# EasyEDA Pro project ProPrj_ExtModule-002_2025-02-19.epro

# Schematic ExtModule-002
Board Name: ExtModule-002; Create Date: 2025-01-21; Page Name: Core; Project Name: ExtModule-002; Schematic Name: Schematic-ExtModule-002; Update Date: 2025-01-21; Company: 嘉立创EDA; Page Size: A4; Version: V1.0
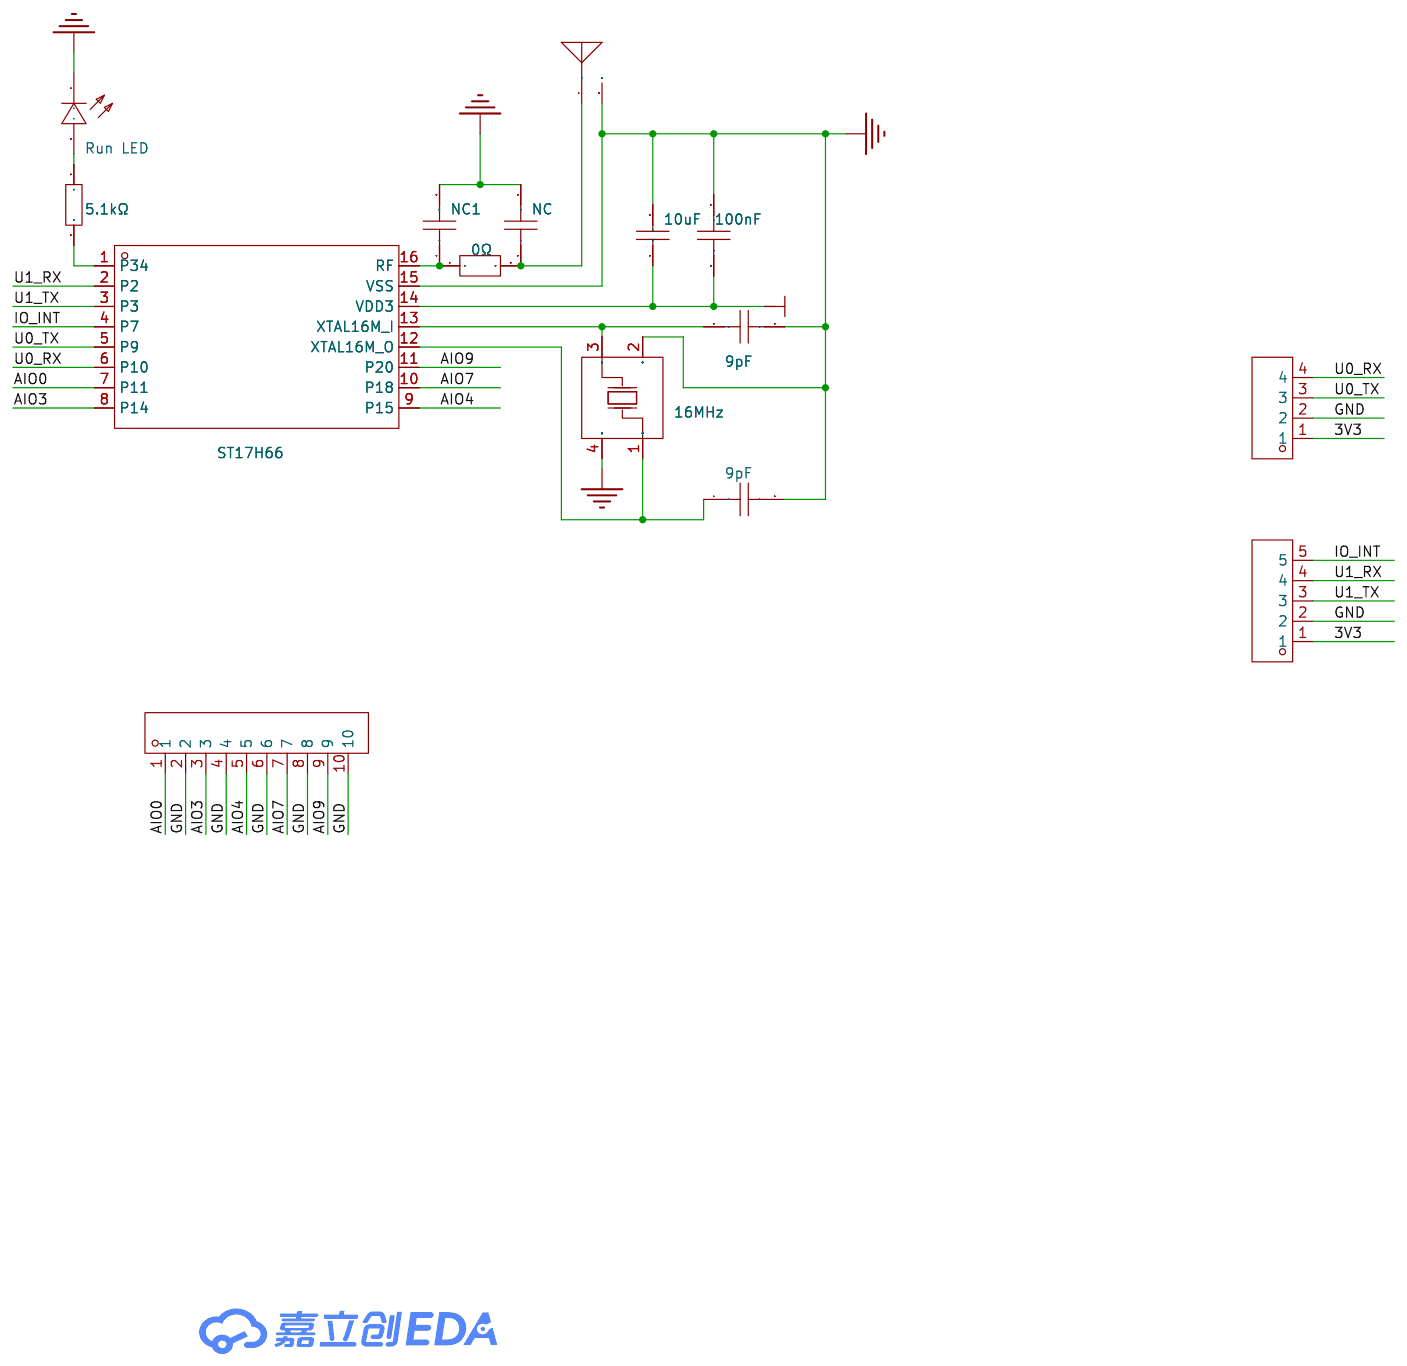
[diagram p0: schematic sheet]

## Parts
C3  100nF  [C0402]
C4  10uF  [C0402]
C5  9pF  [C0402]
C6  9pF  [C0402]
H1  PZ254V-11-04P  [HDR-TH_4P-P2.54-V-M]  (no BOM)
H2  PZ254V-11-05P  [HDR-TH_5P-P2.54-V-M]  (no BOM)
H3  PZ254V-11-10P  [HDR-TH_10P-P2.54-V-M]  (no BOM)
L1  KH-3216-A27  [ANT-SMD_L3.2-W1.6]
LED2  Run LED  [LED0603-RD_RED]
NC  9pF  [C0402]  (no BOM)
NC1  9pF  [C0402]  (no BOM)
R1  0Ω  [R0402]
R18  5.1kΩ  [R0402]
U1  ST17H66  [TSSOP-16_L5.0-W4.4-P0.65-LS6.4-BL]
X1  16MHz  [OSC-SMD_4P-L3.2-W2.5-BL]

## Library data of the parts
C3 = CC0402KRX7R7BB104: 容值:100nF;精度:±10%;额定电压:16V;材质(温度系数):X7R;; LCSC Part Name: 100nF ±10% 16V; Supplier Part: C60474; Manufacturer: YAGEO(国巨); Supplier Footprint: 0402; JLCPCB Part Class: Extended Part; Datasheet: https://atta.szlcsc.com/upload/public/pdf/source/20211223/9278FD768280B81DDBEF48FA36411A03.pdf; Supplier: LCSC; Tolerance: ±10%; Voltage Rated: 16V; Temperature Coefficient: X7R
C4 = CL05A106MQ5NUNC: 容值:10uF;精度:±20%;额定电压:6.3V;材质(温度系数):X5R;; LCSC Part Name: 10uF ±20% 6.3V; Supplier Part: C15525; Manufacturer: SAMSUNG(三星); Supplier Footprint: 0402; JLCPCB Part Class: 基础库; Datasheet: https://atta.szlcsc.com/upload/public/pdf/source/20220823/2B02EE04F8F211D38A52DCB16EB6BEBA.pdf; Supplier: LCSC; Tolerance: ±20%; Voltage Rated: 6.3V; Temperature Coefficient: X5R
C5 C6 = GJM1555C1H9R0CB01D: 容值:9pF;额定电压:50V;材质(温度系数):C0G;; LCSC Part Name: 9pF 50V ±0.25pF; Supplier Part: C85884; Manufacturer: muRata(村田); Supplier Footprint: 0402; JLCPCB Part Class: 扩展库; Datasheet: https://atta.szlcsc.com/upload/public/pdf/source/20200305/C490387_23319AE8C154DEB24C505E6C82A8106A.pdf; Supplier: LCSC; Voltage Rated: 50V; Temperature Coefficient: C0G
H1 = PZ254V-11-04P: 插针结构:1x4P;间距:2.54mm;行距:-;圆针/方针:方针;安装类型:直插;排数:单排;总PIN位数:4P;额定电流:3A;额定电压:250V;配合针长度:6mm;塑高:2.5mm;端接针长度:3mm;触头材质:-;工作温度范围:-40℃~+105℃;颜色:黑色;; LCSC Part Name: 间距:2.54mm 1x4P 直插 方针; Supplier Part: C2691448; Manufacturer: XFCN(兴飞); Supplier Footprint: 插件,P=2.54mm; JLCPCB Part Class: 扩展库; Datasheet: https://atta.szlcsc.com/upload/public/pdf/source/20200309/C492403_F9F19131791D08044AD4F84F8E751A34.pdf; Supplier: LCSC; Pin Structure: 1x4P; Pitch: 2.54mm; Circluar Pins/Square Pins: 方针; Mounting Type: 直插; Number of Rows: 单排; Number of Pins: 4P; Current Rating (Max): 3A; Voltage Rating (Max): 250V; Length of Mating Pin: 6mm; Insulation Height: 2.5mm; Length of End Connection Pin: 3mm; Operating Temperature Range: -40℃~+105℃; Color: 黑色
H2 = PZ254V-11-05P: 插针结构:1x5P;间距:2.54mm;行距:-;圆针/方针:方针;安装类型:直插;排数:单排;总PIN位数:5P;额定电流:-;额定电压:-;配合针长度:6mm;塑高:2.5mm;端接针长度:3mm;触头材质:黄铜;触头镀层:-;工作温度范围:-40℃~+105℃;颜色:黑色;; LCSC Part Name: 间距:2.54mm 1x5P 直插 方针; Supplier Part: C492404; Manufacturer: XFCN(兴飞); Supplier Footprint: 插件,P=2.54mm; JLCPCB Part Class: 扩展库; Datasheet: https://atta.szlcsc.com/upload/public/pdf/source/20200309/C492404_E51533260F8710EFF5D4617281164C1D.pdf; Supplier: LCSC; Pin Structure: 1x5P; Pitch: 2.54mm; Circluar Pins/Square Pins: 方针; Mounting Type: 直插; Number of Rows: 单排; Number of Pins: 5P; Length of Mating Pin: 6mm; Insulation Height: 2.5mm; Length of End Connection Pin: 3mm; Contact Material: 黄铜; Operating Temperature Range: -40℃~+105℃; Color: 黑色
H3 = PZ254V-11-10P: 插针结构:1x10P;间距:2.54mm;行距:-;圆针/方针:方针;安装类型:直插;排数:单排;总PIN位数:10P;额定电流:-;额定电压:-;配合针长度:6mm;塑高:2.5mm;端接针长度:3mm;触头材质:黄铜;触头镀层:-;工作温度范围:-40℃~+105℃;颜色:黑色;; LCSC Part Name: 间距:2.54mm 1x10P 直插 方针; Supplier Part: C492409; Manufacturer: XFCN(兴飞); Supplier Footprint: 插件,P=2.54mm; JLCPCB Part Class: 扩展库; Datasheet: https://atta.szlcsc.com/upload/public/pdf/source/20200309/C492409_129C9431BDD62EBBBD0A643B6AAB9FBD.pdf; Supplier: LCSC; Pin Structure: 1x10P; Pitch: 2.54mm; Circluar Pins/Square Pins: 方针; Mounting Type: 直插; Number of Rows: 单排; Number of Pins: 10P; Length of Mating Pin: 6mm; Insulation Height: 2.5mm; Length of End Connection Pin: 3mm; Contact Material: 黄铜; Operating Temperature Range: -40℃~+105℃; Color: 黑色
L1 = KH-3216-A27: LCSC Part Name: Chip蓝牙贴片3.2x1.6; Supplier Part: C504001; Manufacturer: kinghelm(金航标); Supplier Footprint: 1206; JLCPCB Part Class: 扩展库; Datasheet: https://atta.szlcsc.com/upload/public/pdf/source/20200330/C504001_1885788A99ECD25C59FD63C2239A9775.pdf; Supplier: LCSC
LED2 = NCD0603R1_C84263: 灯头类型:-;发光颜色:红色;正向电压(VF):1.6V~2.6V;功率:65mW;正向电流:20mA;主波长:615nm~630nm;二极管配置:独立二极管;透镜颜色:无色透明透镜;色温:-;发光强度:80mcd~220mcd;发光角度:130°;载带方式:-;工作温度:-30℃~+85℃;; LCSC Part Name: NCD0603R1; Supplier Part: C84263; Manufacturer: 国星光电; Manufacturer Part: NCD0603R1; Supplier Footprint: 0603; JLCPCB Part Class: 扩展库; Datasheet: https://atta.szlcsc.com/upload/public/pdf/source/20200820/C84263_DABC6A75E58F576973B407FDBA283D60.pdf; Supplier: LCSC; Emitted Color: 红色; Forward Voltage (VF): 1.6V~2.6V; Power Dissipation: 65mW; Forward Current: 20mA; Dominant Wavelength: 615nm~630nm; Diode Configuration: 独立二极管; Lens Color: 无色透明透镜; Luminous Intensity: 80mcd~220mcd; Viewing Angle: 130°; Operating Temperature: -30℃~+85℃
NC NC1 = CC0402CRNPO9BN9R0: 容值:9pF;额定电压:50V;材质(温度系数):NP0;; LCSC Part Name: 9pF 50V; Supplier Part: C282242; Manufacturer: YAGEO(国巨); Supplier Footprint: 0402; JLCPCB Part Class: 扩展库; Datasheet: https://atta.szlcsc.com/upload/public/pdf/source/20181008/C309499_21CC21451B82C39E3D92150FD6B30293.pdf; Supplier: LCSC; Voltage Rated: 50V; Temperature Coefficient: NP0
R1 = FRC0402P000 TS: 电阻类型:厚膜电阻;阻值:0Ω;精度:±5%;功率:62.5mW;最大工作电压:50V;; LCSC Part Name: 0Ω ±5% 62.5mW 厚膜电阻; Supplier Part: C2906877; Manufacturer: FOJAN(富捷); Supplier Footprint: 0402; JLCPCB Part Class: 扩展库; Datasheet: https://atta.szlcsc.com/upload/public/pdf/source/20211221/925EC7D7225764EE0046F22065062C87.pdf; Supplier: LCSC; Type: 厚膜电阻; Tolerance: ±5%; Power(Watts): 62.5mW; Overload Voltage (Max): 50V; Operating Temperature Range: -55℃~+155℃
R18 = 0402WGF5101TCE: 阻值:5.1kΩ;精度:±1%;功率:62.5mW;温度系数:±100ppm/℃;电阻类型:厚膜电阻;; LCSC Part Name: 5.1kΩ ±1% 62.5mW 厚膜电阻; Supplier Part: C25905; Manufacturer: UNI-ROYAL(厚声); Supplier Footprint: 0402; JLCPCB Part Class: Basic Part; Datasheet: https://atta.szlcsc.com/upload/public/pdf/source/20200306/C422600_1E6D84923E4A46A82E41ADD87F860B5C.pdf; Supplier: LCSC; Tolerance: ±1%; Power(Watts): 62.5mW; Overload Voltage (Max): 50V; Temperature Coefficient: ±100ppm/℃; Type: 厚膜电阻; Operating Temperature Range: -55℃~+155℃
U1 = ST17H66_C9900054761: Supplier Part: C9900054761; Supplier Footprint: TSSOP16; Supplier: LCSC
X1 = X322516MLB4SI: 晶振类型:贴片晶振;频率:16MHz;常温频差:±10ppm;外接负载电容:9pF;频率稳定度(全温):±20ppm;; LCSC Part Name: 16MHz ±10ppm 9pF; Supplier Part: C13738; Manufacturer: YXC(扬兴晶振); Supplier Footprint: SMD3225-4P; JLCPCB Part Class: 基础库; Datasheet: https://atta.szlcsc.com/upload/public/pdf/source/20240329/19D5F850207469550BEB00D7DFEDBC7A.pdf; Supplier: LCSC; Crystal Type: 贴片晶振; Normal temperature Frequency Tolerance: ±10ppm; External load capacitor: 9pF; Frequency Stability(Full temperature range): ±20ppm; Operating Temperature: -40℃~+85℃

## Nets
3V3: C3.2 C4.2 H1.1 H2.1 U1.14(VDD3)
GND: C3.1 C4.1 C5.2 C6.2 H1.2 H2.2 H3.2 H3.4 H3.6 H3.8 H3.10 L1.2 LED2.1(K) NC.2 NC1.2 U1.15(VSS) X1.2(GND) X1.4(GND)
AIO0: H3.1 U1.7(P11)
AIO3: H3.3 U1.8(P14)
AIO4: H3.5 U1.9(P15)
AIO7: H3.7 U1.10(P18)
AIO9: H3.9 U1.11(P20)
IO_INT: H2.5 U1.4(P7)
U0_RX: H1.4 U1.6(P10)
U0_TX: H1.3 U1.5(P9)
U1_RX: H2.4 U1.2(P2)
U1_TX: H2.3 U1.3(P3)
$1N302: L1.1(ANT) NC.1 R1.2
$1N452: NC1.1 R1.1 U1.16(RF)
$1N920: C5.1 U1.13(XTAL16M_I) X1.3(OSC2)
$1N925: C6.1 U1.12(XTAL16M_O) X1.1(OSC1)
$1N1300: LED2.2(A) R18.1
$1N1306: R18.2 U1.1(P34)

# Board ExtModule-002
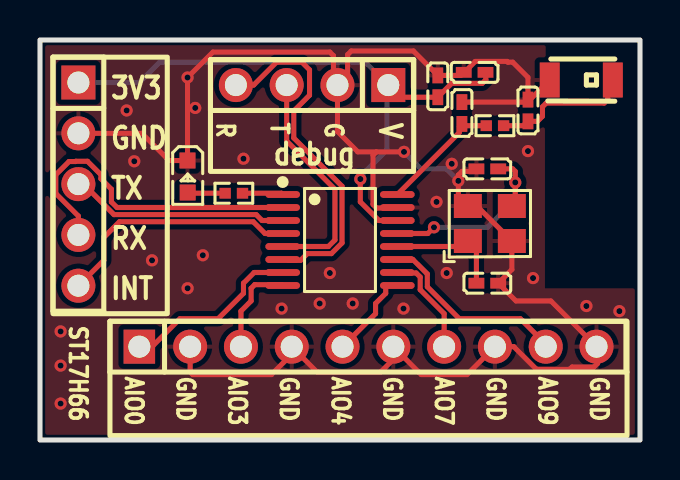
[diagram p1: board, top side]
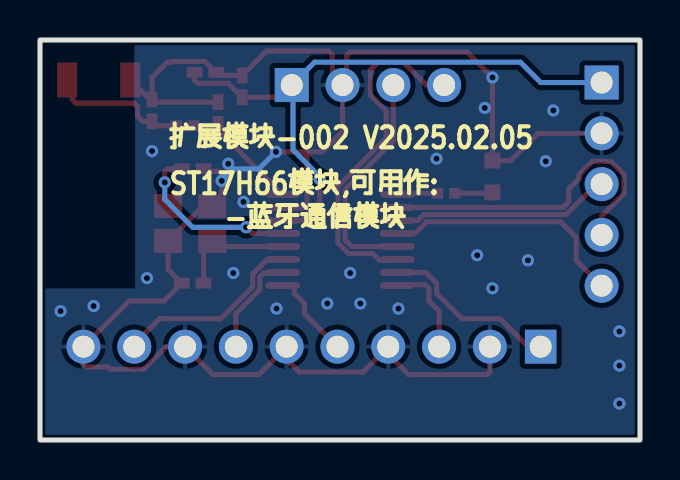
[diagram p2: board, bottom side, seen from below]

Outline 30 x 20 mm; copper layers: Top Layer, Bottom Layer. Coordinates in mm from the lower left corner of the outline.
Outline path: rectangle 0,20 30,0
Stack: Top Layer 0.035mm / Dielectric1 1.51mm FR4 er 4.5 / Bottom Layer 0.035mm

## Design rules (mm)
template: JLCPCB Capability(Two Layers Board)
spacing copperThickness1oz (default): track to track 0.102, other pairs 0.152 to 0.3
spacing copperThickness2oz: track to track 0.203, other pairs 0.152 to 0.3
track width copperThickness1oz (default): min 0.127, default 0.254, max 2.54
track width copperThickness2oz: min 0.203, default 0.254, max 2.54
differential pair differentialPair (default): width min 0.127, default 0.254, max 2.54; gap min 0.152, default 0.152
via viaSize (default): diameter min 0.5, default 0.61, max 10; hole min 0.3, default 0.305, max 6.3

## Placement (name value [footprint] x y rotation side)
C3  100nF  [C0402]  19.89 17.68 270 top
C4  10uF  [C0402]  21.73 18.38 0 top
C5  9pF  [C0402]  22.37 13.56 180 top
C6  9pF  [C0402]  22.37 7.84 0 top
H1  PZ254V-11-04P  [HDR-TH_4P-P2.54-V-M]  13.6 17.75 180 top
H2  PZ254V-11-05P  [HDR-TH_5P-P2.54-V-M]  1.92 12.79 270 top
H3  PZ254V-11-10P  [HDR-TH_10P-P2.54-V-M]  16.4 4.67 0 top
L1  KH-3216-A27  [ANT-SMD_L3.2-W1.6]  27.06 18 180 top
LED2  Run LED  [LED0603-RD_RED]  7.38 13.17 270 top
NC  9pF  [C0402]  24.4 16.48 90 top
NC1  9pF  [C0402]  21.1 16.35 90 top
R1  0Ω  [R0402]  22.75 15.72 0 top
R18  5.1kΩ  [R0402]  9.69 12.34 0 top
U1  ST17H66  [TSSOP-16_L5.0-W4.4-P0.65-LS6.4-BL]  15 10 270 top
X1  16MHz  [OSC-SMD_4P-L3.2-W2.5-BL]  22.49 10.83 0 top

## Footprints (pads in the part's own frame, mm; a bottom-side part is the same pattern mirrored in y, then rotated)
ANT-SMD_L3.2-W1.6
  rect 1x1.75 smd: 1(-1.578,0) 2(1.578,0)
C0402
  rect 0.79x0.54 smd: 1(-0.545,0) 2(0.545,0)
HDR-TH_4P-P2.54-V-M
  rect 1.7x1.7 hole 1.1: 1(-3.81,0)
  round 1.7 hole 1.1: 2(-1.27,0) 3(1.27,0) 4(3.81,0)
HDR-TH_5P-P2.54-V-M
  rect 1.7x1.7 hole 1.1: 1(-5.08,0)
  round 1.7 hole 1.1: 2(-2.54,0) 3(0,0) 4(2.54,0) 5(5.08,0)
HDR-TH_10P-P2.54-V-M
  rect 1.575x1.7 hole 1.1: 1(-11.43,0)
  round 1.7 hole 1.1: 2(-8.89,0) 3(-6.35,0) 4(-3.81,0) 5(-1.27,0) 6(1.27,0) 7(3.81,0) 8(6.35,0) 9(8.89,0) 10(11.43,0)
LED0603-RD_RED
  rect 0.8x0.8 smd: 1(-0.799,-0.004) 2(0.799,0.004)
OSC-SMD_4P-L3.2-W2.5-BL
  rect 1.4x1.2 smd: 1(-1.1,-0.875) 2(1.1,-0.875) 3(1.1,0.875) 4(-1.1,0.875)
R0402
  rect 0.566x0.54 smd: 1(-0.433,0) 2(0.433,0)
TSSOP-16_L5.0-W4.4-P0.65-LS6.4-BL
  oval 0.343x1.732 smd: 1(-2.275,-2.866) 2(-1.625,-2.866) 3(-0.975,-2.866) 4(-0.325,-2.866) 5(0.325,-2.866) 6(0.975,-2.866) 7(1.625,-2.866) 8(2.275,-2.866) 9(2.275,2.866) 10(1.625,2.866) 11(0.975,2.866) 12(0.325,2.866) 13(-0.325,2.866) 14(-0.975,2.866) 15(-1.625,2.866) 16(-2.275,2.866)

## Nets
As in the schematic.

## Via types
v1: diameter 0.61, hole 0.305, Top Layer to Bottom Layer, 28 vias

## Routing (per net, layer and track width the routed paths; a pad name or vN(x,y) marks a point on that pad's centre or on a via; arc(x,y) is an arc through that point)
3V3: length 30.9
  Top Layer w0.254: H1.1 18.02,17.14 C3.2 20.58,17.83 22.11,17.83 22.29,18.01 22.29,18.37 C4.2 ; v1(16.02,13.05) 16.02,11.91 16.95,10.97 U1.14
  Bottom Layer w0.254: v1(16.02,13.05) 16.02,13.17 17.35,14.51 17.35,17.68 H1.1 16.27,18.89 5.98,18.89 4.97,17.87 H2.1
GND: length 91.8
  Top Layer w0.254: 21.82,13.56 21.69,13.43 21.1,13.43 20.92,13.25 20.92,12.18 X1.4 21.84,11.7 X1.2 23.59,8.52 C6.2 23.8,6.95 25.54,6.95 H3.10 27.88,4.61 27.88,3.83 27.7,3.65 26.6,3.65 26.49,3.54 24.82,3.54 23.69,4.67 H3.8 21.35,3.27 19.06,3.27 H3.6 17.67,4.03 17.03,3.4 13.86,3.4 H3.4 12.59,4.28 11.57,3.27 7.63,3.27 7.51,3.4 H3.2 ; NC.2 24.51,17.02 L1.2 ; NC.2 24.4,18.13 23.64,18.89 23.39,18.89 23.35,18.93 21.77,18.93 21.22,18.38 C4.1 21.03,18.23 C3.1 18.67,19.45 15.56,19.45 15.38,19.27 15.38,18.25 14.87,17.75 ; NC.2 24.27,16.89 NC1.2 ; 16.82,14.41 16.65,14.24 16.65,11.78 16.83,11.6 17.84,11.6 U1.15 ; 16.82,14.41 15.89,14.41 14.87,15.42 14.87,17.75 ; 16.82,14.41 v1(18.2,14.41) ; 14.87,17.75 14.67,17.95 14.67,19.22 14.49,19.4 8.65,19.4 v1(7.38,18.12) LED2.1 6.45,13.97 5.09,15.33 H2.2
  Bottom Layer w0.254: v1(20.92,12.96) 20.32,13.56 19.05,13.56 v1(18.2,14.41)
  vias: v1(1.03,5.43) v1(1.03,3.72) v1(1.03,1.82) v1(4.33,16.48) v1(4.71,13.94) v1(5.6,8.98) v1(7.38,7.59) v1(7.76,16.6) v1(8.14,9.24) v1(10.17,14.06) v1(12.08,6.57) v1(13.98,6.83) v1(14.49,8.35) v1(15.63,6.83) v1(18.18,6.57) v1(19.83,11.91) v1(20.33,8.35) v1(20.59,13.81) v1(24.4,14.44) v1(24.65,8.09) v1(27.32,6.7) v1(28.97,6.44)
AIO0: length 9
  Top Layer w0.254: U1.7 10.71,8.38 10.17,7.84 10.17,7.33 8.9,6.06 7,6.06 5.6,4.67 4.97,4.67
AIO3: length 4.8
  Top Layer w0.254: H3.3 10.05,6.44 10.56,6.95 10.56,7.59 10.73,7.77 12.09,7.77 U1.8
AIO4: length 3.8
  Top Layer w0.254: 17.29,7.59 17.29,7.33 16.78,6.83 16.78,6.32 15.13,4.67
AIO7: length 5.2
  Top Layer w0.254: H3.7 20.21,6.32 19.01,7.51 19.01,8.15 18.81,8.35 17.89,8.35 U1.10
AIO9: length 9.7
  Top Layer w0.254: 25.29,4.67 25.29,4.79 24.02,6.06 20.96,6.06 19.37,7.66 19.37,8.3 18.64,9.03 U1.11
IO_INT: length 12.5
  Top Layer w0.254: H2.5 3.19,8.98 3.19,10.13 3.97,10.91 10.66,10.91 11.25,10.33 U1.4
U0_RX: length 17.6
  Top Layer w0.254: H1.4 10.68,17.75 11.82,18.89 13.09,18.89 13.48,18.51 13.48,17.24 12.69,16.45 12.69,15.1 15.1,12.69 15.1,9.85 14.57,9.32 13.36,9.32 13.03,8.98 12.43,8.98 12.39,9.03 U1.6
U0_TX: length 11.5
  Top Layer w0.254: U1.5 14.42,9.67 14.75,10 14.75,12.54 12.33,14.95 H1.3
U1_RX: length 16.5
  Top Layer w0.254: U1.2 3.85,11.62 3.57,11.91 3.57,12.54 3.05,13.06 3.05,13.26 2.37,13.94 1.79,13.94 1.78,13.92 1.45,13.92 0.79,13.26 0.79,12.33 1.92,11.2 H2.4
U1_TX: length 11
  Top Layer w0.254: H2.3 2.17,12.79 3.7,11.27 10.81,11.27 11.1,10.97 U1.3
$1N302: length 7.1
  Top Layer w0.254: L1.1 28.39,17.75 28.39,17.03 28.21,16.85 25.31,16.85 25.12,16.66 25.12,16.19 24.87,15.93 NC.1 24.18,15.72 R1.2
$1N452: length 6.1
  Top Layer w0.254: U1.16 20.97,15.38 20.97,15.68 NC1.1 21.19,15.72 R1.1
$1N920: length 10.2
  Top Layer w0.254: U1.13 19.39,10.33 v1(19.7,10.64) ; X1.3 23.76,11.87 v1(23.76,12.88) 23.76,13.43 23.64,13.56 C5.1
  Bottom Layer w0.254: v1(19.7,10.64) 22.37,10.64 23.76,12.03 23.76,12.92
$1N925: length 5.9
  Top Layer w0.254: 21.82,7.84 21.82,9.52 X1.1 21.12,9.67 U1.12
$1N1300: length 1.9
  Top Layer w0.254: LED2.2 7.42,12.34 R18.1
$1N1306: length 2
  Top Layer w0.254: U1.1 12.07,12.34 R18.2

## Copper pours and planes (outline as drawn; the poured copper is in the pictures)
GND on Top Layer: -1.51,21.56 30.62,21.56 30.62,-1.05 -1.51,-1.05
GND on Bottom Layer: -0.49,20.67 31.13,20.67 31.13,-0.67 -0.49,-0.67

## Text on the board
Bottom Silkscreen Layer: ST17H66模块,可用作: / -蓝牙通信模块 | 扩展模块-002 V2025.02.05
Top Silkscreen Layer: ST17H66 | AIO0 | GND | R | AIO3 | T | G | AIO4 | AIO7 | AIO9 | 3V3 | TX | RX | INT | debug | V
